# Altium project PA_Channel.PrjPcb
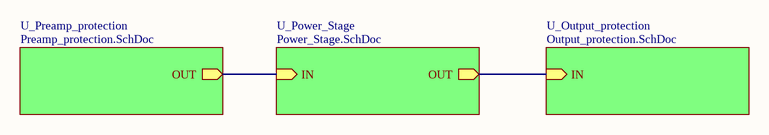
[diagram p0: PA_Channel.SchDoc]
5 sheets, 150 parts. Net scope: hierarchical (ports join the sheet entries above them; power ports are global).
Board files: PA_Channel_RF1.PcbDoc, PA_Channel_RF2.PcbDoc, PA_Channel_RF3.PcbDoc, PA_Channel_RF2_NPTB00004A.PcbDoc
Sheets:
  PA_Channel.SchDoc
    U_Output_protection = Output_protection.SchDoc
    U_Power_Stage = Power_Stage.SchDoc
    U_Preamp_protection = Preamp_protection.SchDoc
  Power_Stage_NPTB00004A.SchDoc

## Sheet PA_Channel.SchDoc
size A4

### Sub-sheets
U_Output_protection = Output_protection.SchDoc: IN (in)
U_Power_Stage = Power_Stage.SchDoc: IN (in), OUT (out)
U_Preamp_protection = Preamp_protection.SchDoc: OUT (out)

### Nets
NetC24_1: sheet U_Power_Stage/IN, sheet U_Preamp_protection/OUT
NetCP1_1: sheet U_Output_protection/IN, sheet U_Power_Stage/OUT

## Sheet Output_protection.SchDoc
size A3
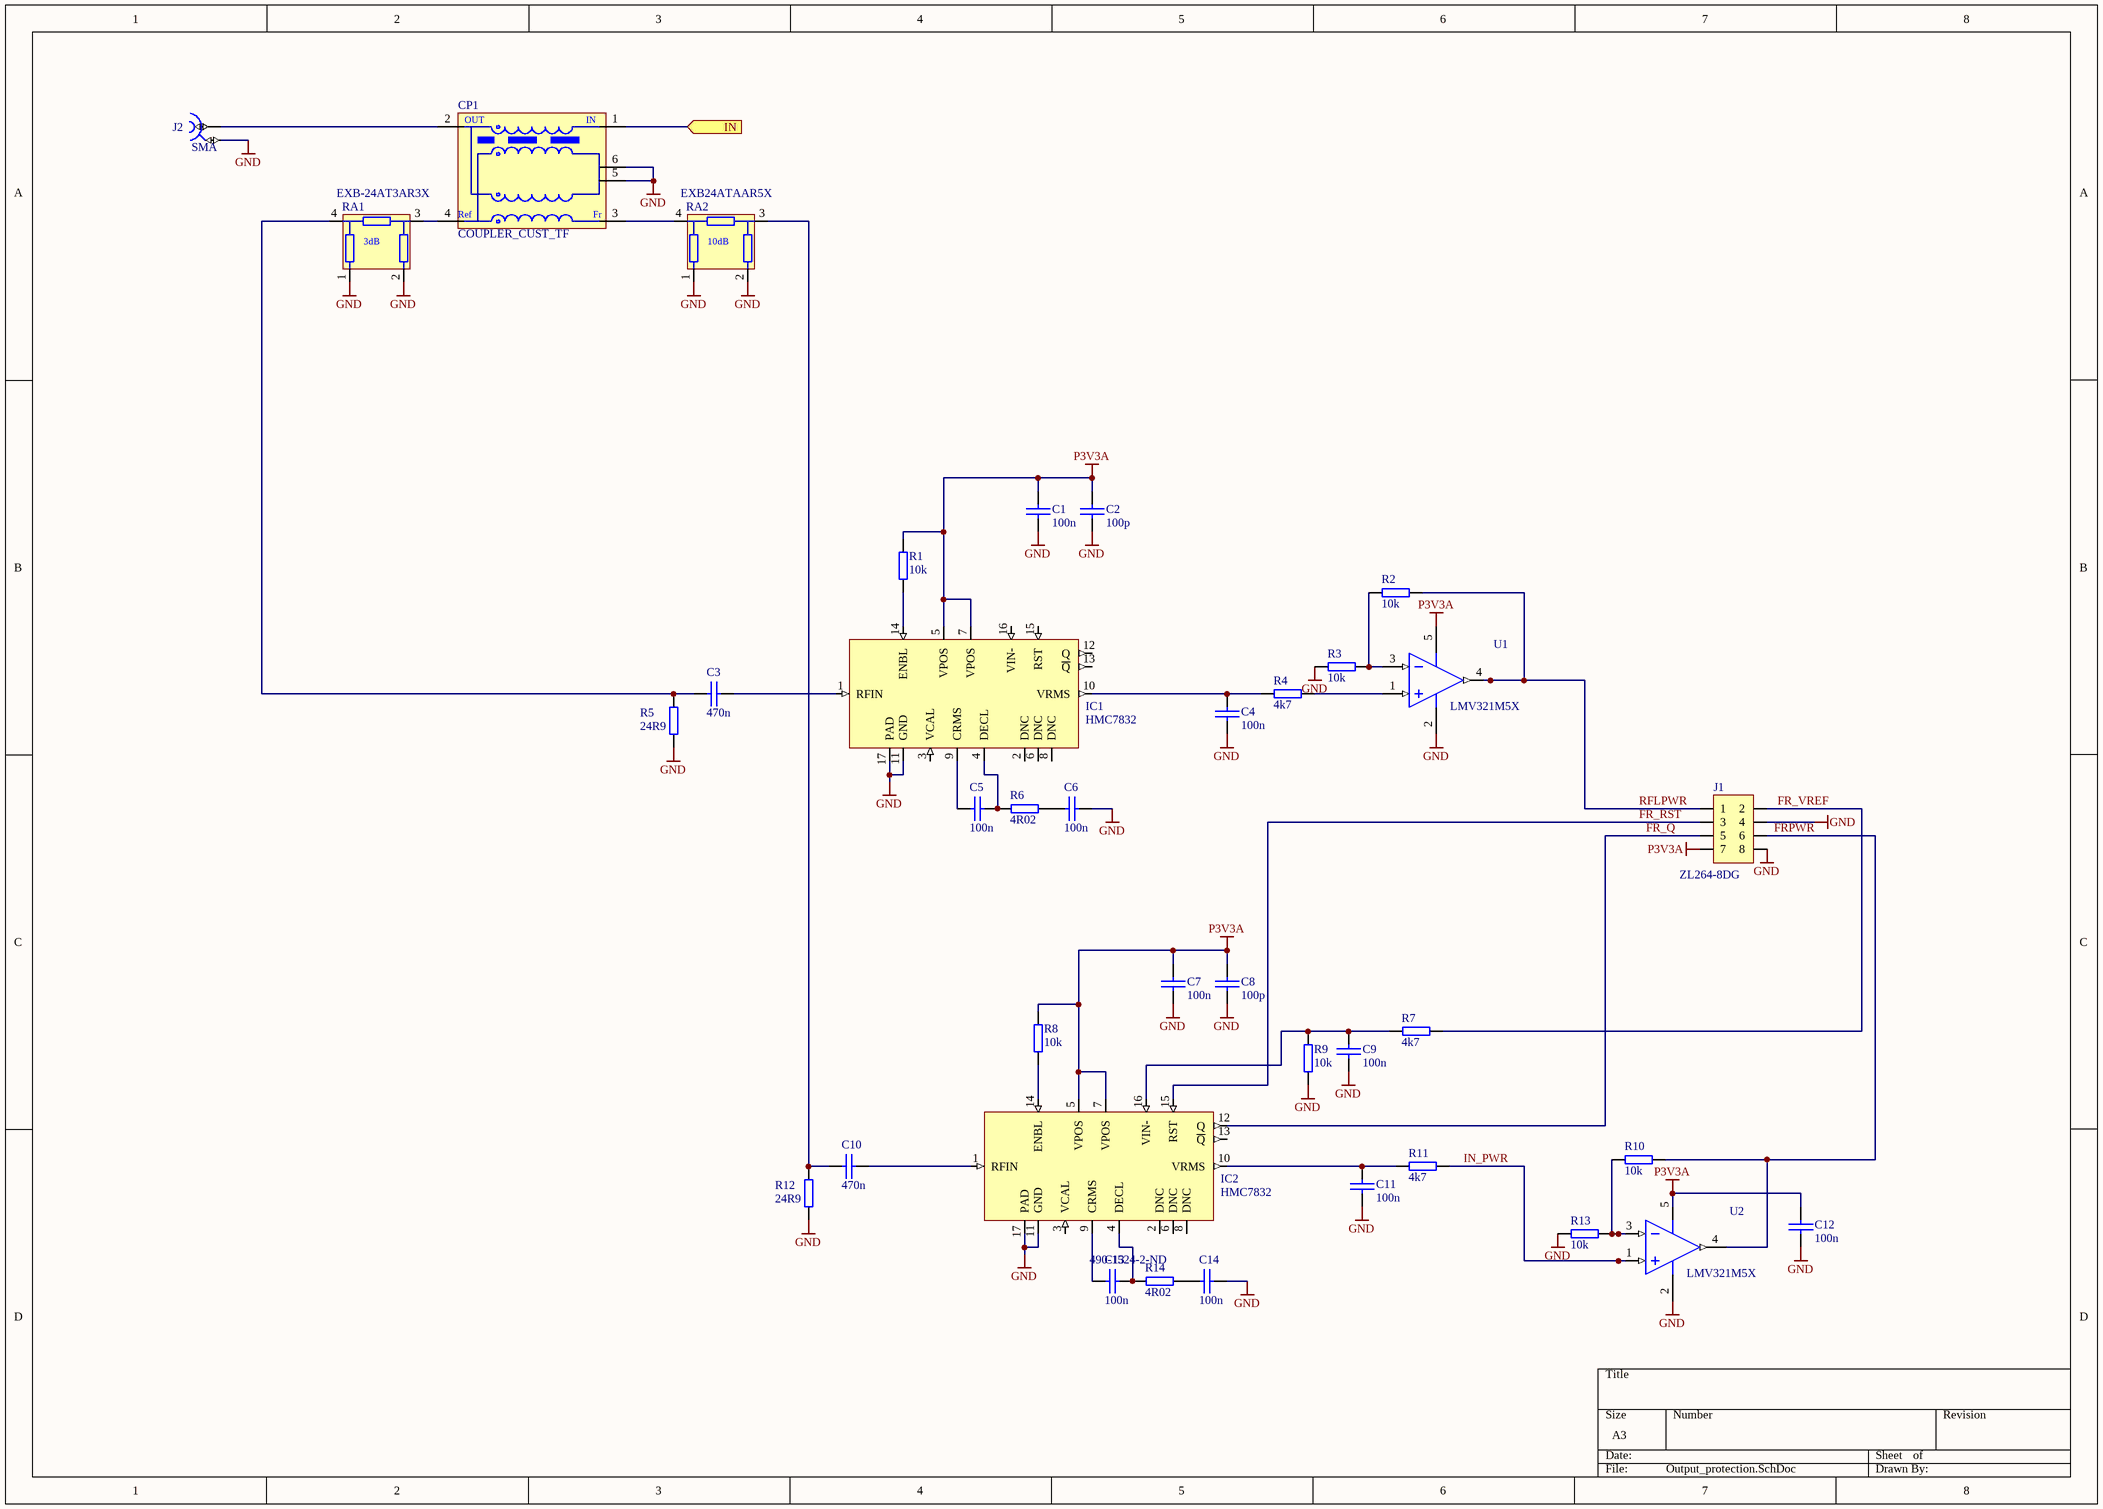
[diagram p1: Output_protection.SchDoc]

### Parts
(Parts that share a designator on the sheet are numbered #1, #2 ... from top to bottom, then left to right.)
C1#1  100n  [0603C]
C2#1  100p  [0603C]
C3#1  470n  [0603C]
C4#1  100n  [0603C]
C5#1  100n  [0603C]
C6  100n  [0603C]
C7  100n  [0603C]
C8  100p  [0603C]
C9  100n  [0603C]
C10  470n  [0603C]
C11  100n  [0603C]
C12  100n  [0603C]
C13  100n  Supplier Part Number 1: 490-1524-2-ND  [0603C]
C14  100n  [0603C]
CP1  COUPLER_CUST_TF  [COUPLER_CUST_TF]
IC1#1  HMC7832  [QFN50P300X300X80_HS-17N]
IC2  HMC7832  [QFN50P300X300X80_HS-17N]
J1  ZL264-8DG  [ZL264-8DG]
J2  SMA  [MOLEX_73251-2121]
R1#1  10k  [0603R]
R2#1  10k  [0603R]
R3  10k  [0603R]
R4  4k7  [0603R]
R5  24R9  [0603R]
R6  4R02  [0603R]
R7  4k7  [0603R]
R8  10k  [0603R]
R9  10k  [0603R]
R10  10k  [0603R]
R11  4k7  [0603R]
R12  24R9  [0603R]
R13  10k  [0603R]
R14  4R02  [0603R]
RA1  EXB-24AT3AR3X  [CAC-65P100X100-4L]
RA2  EXB24ATAAR5X  [CAC-65P100X100-4L]
U1  LMV321M5X  [DBV0005A_N]
U2  LMV321M5X  [DBV0005A_N]

### Ports
IN (in)

### Nets
GND: C1#1.2 C2#1.2 C4#1.1 C6.2 C7.2 C8.2 C9.1 C11.1 C12.1 C14.2 CP1.5 CP1.6 IC1#1.11(GND) IC1#1.17(PAD) IC2.11(GND) IC2.17(PAD) J1.4 J1.8 J2.2 R3.2 R5.2 R9.1 R12.2 R13.2 RA1.1 RA1.2 RA2.1 RA2.2 U1.2(V-) U2.2(V-)
P3V3A: C1#1.1 C2#1.1 C7.1 C8.1 C12.2 IC1#1.5(VPOS) IC1#1.7(VPOS) IC2.5(VPOS) IC2.7(VPOS) J1.7 R1#1.1 R8.1 U1.5(V+) U2.5(V+)
FR_Q: IC2.12(Q) J1.5
FR_RST: IC2.15(RST) J1.3
FR_VREF: J1.2 R7.1
FRPWR: J1.6 R10.1 U2.4(OUT)
IN_PWR: R11.1 U2.1(IN+)
RFLPWR: J1.1 R2#1.1 U1.4(OUT)
NetC3#1_1: C3#1.1 R5.1 RA1.4
NetC3#1_2: C3#1.2 IC1#1.1(RFIN)
NetC4#1_2: C4#1.2 IC1#1.10(VRMS) R4.2
NetC5#1_1: C5#1.1 IC1#1.9(CRMS)
NetC5#1_2: C5#1.2 IC1#1.4(DECL) R6.1
NetC6_1: C6.1 R6.2
NetC9_2: C9.2 IC2.16(VIN-) R7.2 R9.2
NetC10_1: C10.1 R12.1 RA2.3
NetC10_2: C10.2 IC2.1(RFIN)
NetC11_2: C11.2 IC2.10(VRMS) R11.2
NetC13_1: C13.1 IC2.9(CRMS)
NetC13_2: C13.2 IC2.4(DECL) R14.1
NetC14_1: C14.1 R14.2
NetCP1_1: CP1.1 ; port IN
NetCP1_2: CP1.2 J2.1
NetCP1_3: CP1.3 RA2.4
NetCP1_4: CP1.4 RA1.3
NetIC1#1_14: IC1#1.14(ENBL) R1#1.2
NetIC2_14: IC2.14(ENBL) R8.2
NetR2#1_2: R2#1.2 R3.1 U1.3(IN-)
NetR4_1: R4.1 U1.1(IN+)
NetR10_2: R10.2 R13.1 U2.3(IN-)

Not connected (* = marked no-connect by the designer): IC1#1 2(DNC) 3(VCAL) 6(DNC) 8(DNC) 12(Q) 13(~{Q}) 15(RST) 16(VIN-); IC2 2(DNC) 3(VCAL) 6(DNC) 8(DNC) 13(~{Q})

### Notes on the sheet
- (in symbol IND_COUPLER_TF) OUT; IN; Ref; Fr
- (in symbol RES_ATT_3dB) 3dB
- (in symbol RES_ATT_10dB) 10dB

### Library data of the parts
C1#1 C4#1 C5#1 C6 C7 C9 C11-C14 = CAP_SMD_0603: Capacitor SMD; Part: GRM188L81H104KA93D
  C1#1 C4#1 C5#1 C6 C9 C11 C12 C14: Supplier 1: Digi-Key
C2#1 C8 = CAP_SMD_0603: Capacitor SMD; Part: C1608NP01H101J080AA; Supplier 1: Digi-Key
C3#1 C10 = CAP_SMD_0603: Capacitor SMD; Part: GRM188R71A474KA61D; Supplier 1: Digi-Key
CP1 = IND_COUPLER_TF: custom coupler
IC1#1 IC2 = ADL5904: DC   to 6 GHz  , 45 dB DC  to 6 GHz , 45 dB TruPwr Detector with Envelope Threshold Detection
J1 = CON_2X4 2.54 SMT FEM: 2.54mm pitch connector
J2 = MOLEX_73251-2121: Part Description: 50 Ohm, SMA Edge Mount PCB, With Jam Nut And Lock Washer; Manufacturer: MOLEX; PressFit: No; Part Number: MOLEX_73251-2121; Component Kind: Standard; Component Type: Standard; Pin Count: 5; Family: SMA; Mounted: Yes; Socket: No; SMD: Yes; Sense: No; Status: None; Manufacturer Part Number: 73251-2121; ComponentHeight: 5.75mm; HelpURL: \\cern.ch\dfs\Applications\Altium\Datasheets\MOLEX_73251-2121.pdf; Author: CERN DEM JLC; CreateDate: 26.10.2016; LatestRevisionDate: 26.10.2016
R1#1 R2#1 R3 R8-R10 R13 = RES_0603: SMD Resistor; Part: CRCW060310K0FKEA; Supplier 1: Newark
  R2#1 R3 R8 R10 R13: Supplier Part Number 1: 39K0073
R4 R7 R11 = RES_0603: SMD Resistor; Part: CR0603-FX-4701ELF; Supplier 1: Newark; Supplier Part Number 1: 39K0073
R5 R12 = RES_0603: SMD Resistor; Part: CPF0603F24R9C1; Supplier 1: Newark
R6 = RES_0603: SMD Resistor; Part: CRCW06034R02FKEA; Supplier 1: Newark
R14 = RES_0603: SMD Resistor; Supplier 1: Newark; Supplier Part Number 1: 39K0073
RA1 = RES_ATT_3dB: 3dB Chip Attenuator
RA2 = RES_ATT_10dB: 10dB Chip Attenuator
U1 U2 = CMP-0055-01048-3: General Purpose, Low Voltage, Rail-to-Rail Output Operational Amplifiers, 5-pin SOT-23; Manufacturer: Texas Instruments; PackageTopMarking: A13*XTT; PowerWise: N; Package Reference: DBV0005A; PackageDescription: Molded SOT-23, .115 x .063 x .040 in Body, 5 Lead, .0375 in Pitch; CompType: Amplifiers; RoHS: N; ComponentLink1URL: http://www.ti.com/general/docs/lit/getliterature.tsp?genericPartNumber=LMV321-N&fileType=pdf; PinCount: 5; ComponentLink1Description: Datasheet URL

## Sheet Power_Stage.SchDoc
size A4
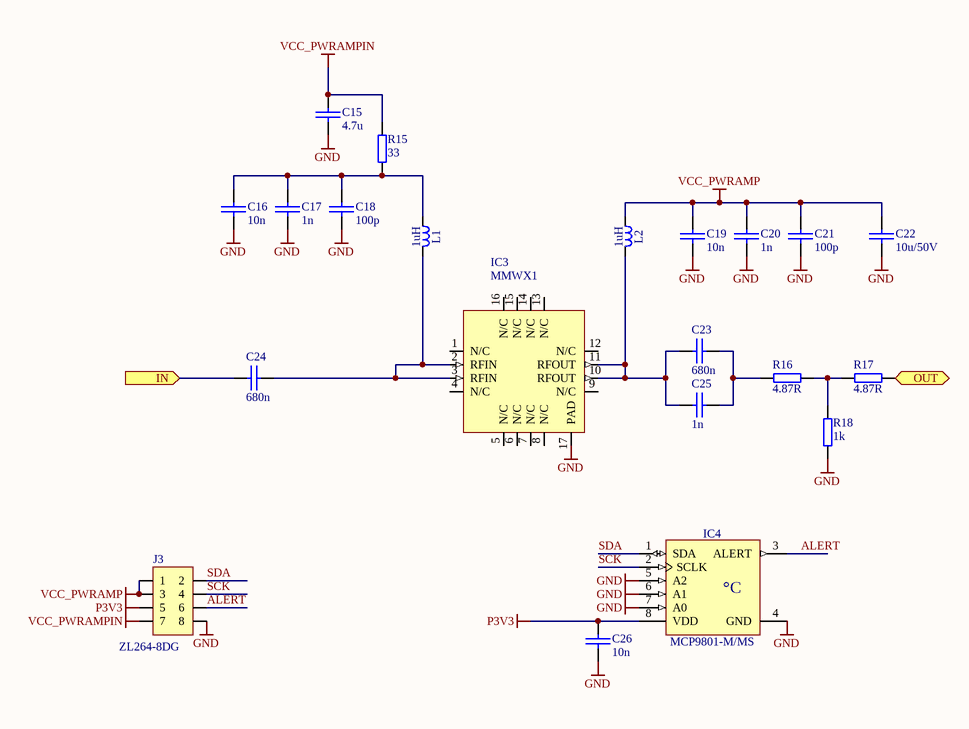
[diagram p2: Power_Stage.SchDoc]

### Parts
(Parts that share a designator on the sheet are numbered #1, #2 ... from top to bottom, then left to right.)
C15#1  4.7u  [0603C]
C16#1  10n  [0603C]
C17#1  1n  [0603C]
C18#1  100p  [0603C]
C19#1  10n  [0603C]
C20#1  1n  [0603C]
C21#1  100p  [0603C]
C22#1  10u/50V  [0805C]
C23  680n  [0603C]
C24  680n  [0603C]
C25  1n  [0603C]
C26#1  10n  [0603C]
IC3  MMWX1  [QFN65P400X400X80_HS-17N]
IC4#1  MCP9801-M/MS  [SOP65P490X110-8N]
J3#1  ZL264-8DG  [ZL264-8DG]
L1#1  1uH  [INDP2520X18L]
L2#1  1uH  [INDP2520X18L]
R15#1  33  [0603R]
R16  4.87R  [0603R]
R17  4.87R  [0603R]
R18  1k  [0603R]

### Ports
IN (in), OUT (out)

### Nets
GND: C15#1.2 C16#1.2 C17#1.2 C18#1.2 C19#1.2 C20#1.2 C21#1.2 C22#1.2 C26#1.1 IC3.17(PAD) IC4#1.4(GND) IC4#1.5(A2) IC4#1.6(A1) IC4#1.7(A0) J3#1.8 R18.1
P3V3: C26#1.2 IC4#1.8(VDD) J3#1.5
VCC_PWRAMP: C19#1.1 C20#1.1 C21#1.1 C22#1.1 J3#1.1 J3#1.3 L2#1.1
VCC_PWRAMPIN: C15#1.1 J3#1.7 R15#1.2
ALERT: IC4#1.3(ALERT) J3#1.6
SCK: IC4#1.2(SCLK) J3#1.4
SDA: IC4#1.1(SDA) J3#1.2
NetC16#1_1: C16#1.1 C17#1.1 C18#1.1 L1#1.1 R15#1.1
NetC23_1: C23.1 C25.1 IC3.10(RFOUT) IC3.11(RFOUT) L2#1.2
NetC23_2: C23.2 C25.2 R16.1
NetC24_1: C24.1 ; port IN
NetC24_2: C24.2 IC3.2(RFIN) IC3.3(RFIN) L1#1.2
NetCP1_1: R17.2 ; port OUT
NetR16_2: R16.2 R17.1 R18.2

Not connected (* = marked no-connect by the designer): IC3 1(N/C) 4(N/C) 5(N/C) 6(N/C) 7(N/C) 8(N/C) 9(N/C) 12(N/C) 13(N/C) 14(N/C) 15(N/C) 16(N/C)

### Notes on the sheet
- (in symbol MCP9801-M/MS) °C

### Library data of the parts
C15#1 = CAP_SMD_0603: Capacitor SMD; Part: GRM21BR71C475KE51L; Supplier 1: Digi-Key; Supplier Part Number 1: 490-1524-2-ND
C16#1 C19#1 = CAP_SMD_0603: Capacitor SMD; Part: GRM1885C1H103JA01D; Supplier 1: Digi-Key; Supplier Part Number 1: 490-1524-2-ND
C17#1 C20#1 C25 = CAP_SMD_0603: Capacitor SMD; Part: GRM1885C1H102JA01D; Supplier 1: Digi-Key; Supplier Part Number 1: 490-1524-2-ND
C18#1 C21#1 = CAP_SMD_0603: Capacitor SMD; Part: C1608NP01H101J080AA; Supplier 1: Digi-Key; Supplier Part Number 1: 490-1524-2-ND
C22#1 = CAP_SMD_0805: Capacitor SMD; Part: GRM32ER71H106KA12L; Supplier 1: Farnell; Supplier Part Number 1: 1833812
C23 C24 = CAP_SMD_0603: Capacitor SMD; Part: GRM1555C1H681GA01; Supplier 1: Digi-Key; Supplier Part Number 1: 490-1524-2-ND
C26#1 = CAP_SMD_0603: Capacitor SMD; Supplier 1: Digi-Key; Supplier Part Number 1: 490-1524-2-ND
IC3 = RF_NPA1003QA
IC4#1 = MCP9801-M/MS: 2-Wire High-Accuracy Temperature Sensor; Manufacturer: MICROCHIP TECHNOLOGIY; PressFit: No; Bonding: No; Part Number: MCP9801-M/MS; Component Kind: Standard; Component Type: Standard; Device: MCP9801-M/MS; PackageDescription: SOP, 0.65mm pitch; 8 pin, 3.00mm W X 3.00mm L X 1.10mm H body, IPC Medium Density; Part Description: 2-Wire High-Accuracy Temperature Sensor; Manufacturer Part Number: MCP9801-M/MS; Pin Count: 8; Case: MSOP8; Mounted: Yes; Socket: No; SMD: Yes; Sense: No; ComponentHeight: 1.1mm; HelpURL: \\cern.ch\dfs\Applications\Altium\Datasheets\MCP9801-M-MS.pdf; Author: CERN DEM JLC; CreateDate: 18.11.2009; LatestRevisionDate: 18.11.2009
J3#1 = CON_2X4 2.54 SMT FEM: 2.54mm pitch connector
L1#1 = L_1008_100u: Part: LQW2UAS1R0J00L; Author: GK
L2#1 = L_1008_100u: 100uH, 60mA, 21R; Part: 1008LS-102XJLB; Author: GK
R15#1 = RES_0603: SMD Resistor; Part: CR0603-FX-33R0ELF; Supplier 1: Newark; Supplier Part Number 1: 39K0073
R16 R17 = RES_0603: SMD Resistor; Part: CPF0603B4R87E1; Supplier 1: Newark; Supplier Part Number 1: 39K0073
R18 = RES_0603: SMD Resistor; Part: RP73PF1J1K0BTDF; Supplier 1: Newark; Supplier Part Number 1: 39K0073

## Sheet Preamp_protection.SchDoc
size A4
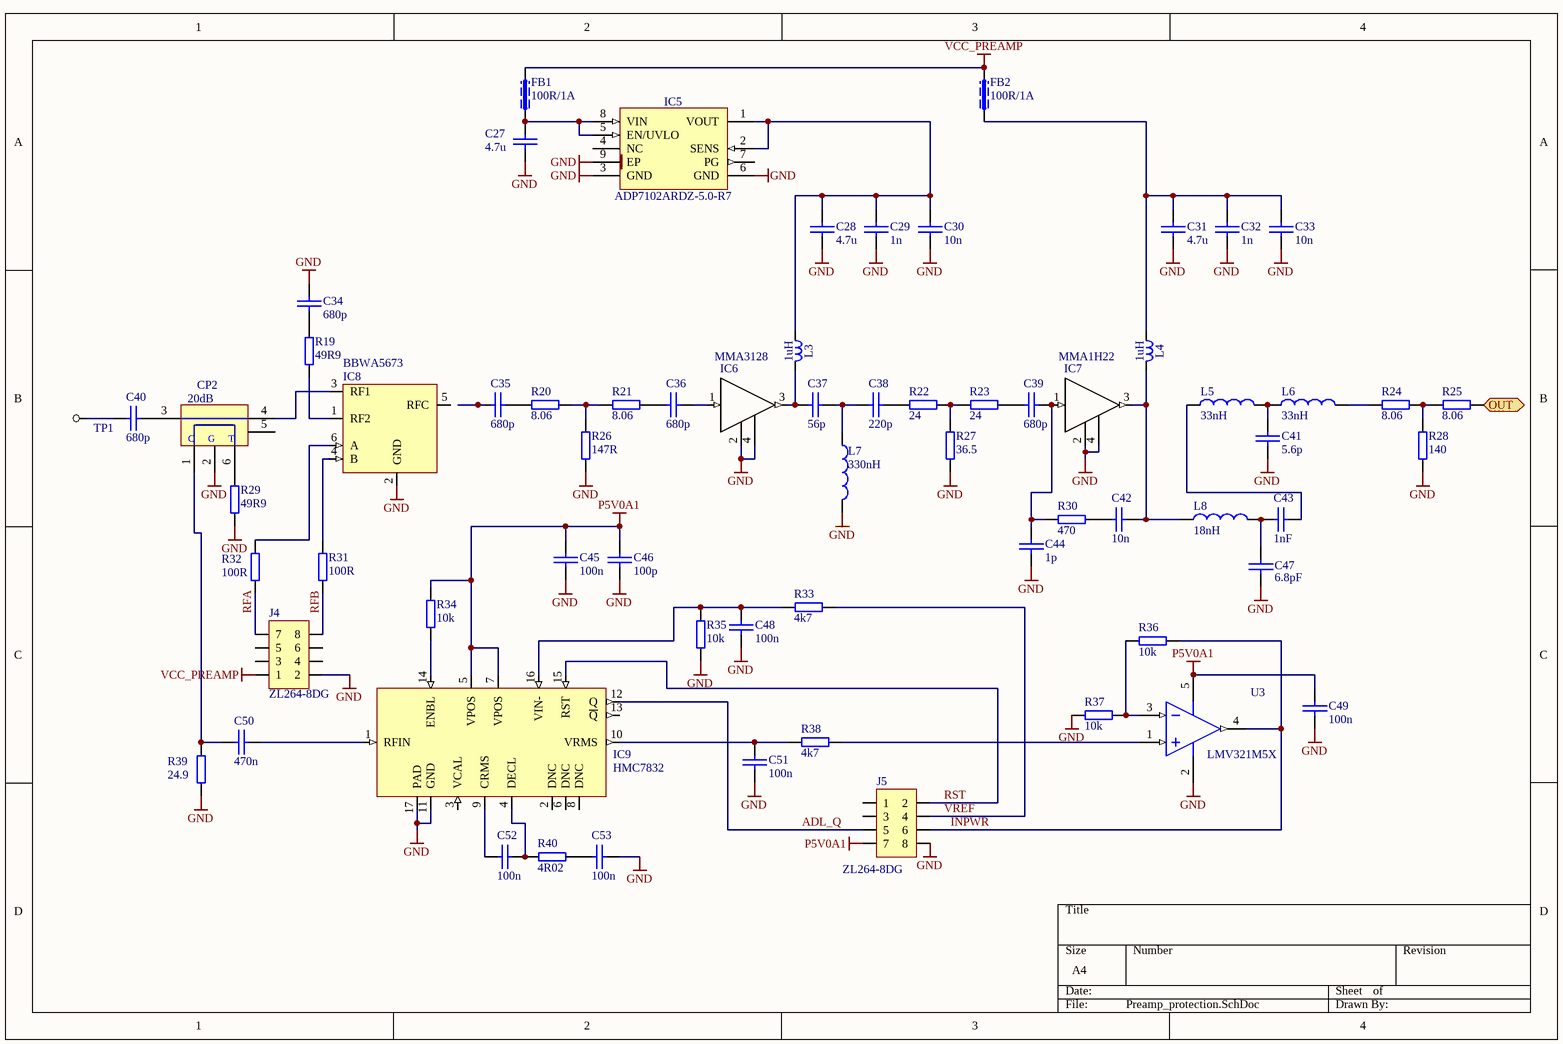
[diagram p3: Preamp_protection.SchDoc]

### Parts
(Parts that share a designator on the sheet are numbered #1, #2 ... from top to bottom, then left to right.)
C27  4.7u  [0603C]
C28  4.7u  [0603C]
C29  1n  [0603C]
C30  10n  [0603C]
C31  4.7u  [0603C]
C32  1n  [0603C]
C33  10n  [0603C]
C34  680p  [0603C]
C35  680p  [0603C]
C36  680p  [0603C]
C37  56p  [0603C]
C38#1  220p  [0603C]
C39  680p  [0603C]
C40  680p  [0603C]
C41  5.6p  [0603C]
C42  10n  [0603C]
C43  1nF  [0603C]
C44  1p  [0603C]
C45  100n  [0603C]
C46  100p  [0603C]
C47  6.8pF  [0603C]
C48  100n  [0603C]
C49  100n  [0603C]
C50  470n  [0603C]
C51  100n  [0603C]
C52  100n  [0603C]
C53  100n  [0603C]
CP2  20dB  [XFMR_MINI-CIRCUITS_AT224]
FB1  100R/1A  [0603L]
FB2  100R/1A  [0603L]
IC5  ADP7102ARDZ-5.0-R7  [SOIC127P600X175-9N-R241X309]
IC6  MMA3128  [SOT89-150P410X170-3N]
IC7  MMA1H22  [SOT89-150P410X170-3N]
IC8  BBWA5673  [SOT95P280X130-6N]
IC9  HMC7832  [QFN50P300X300X80_HS-17N]
J4  ZL264-8DG  [ZL264-8DG]
J5  ZL264-8DG  [ZL264-8DG]
L3#1  1uH  [INDP2520X18L]
L4#1  1uH  [INDP2520X18L]
L5  33nH  [0603L]
L6  33nH  [0603L]
L7  330nH  [0603L]
L8  18nH  [0603L]
R19  49R9  [0603R]
R20  8.06  [0603R]
R21  8.06  [0603R]
R22  24  [0603R]
R23  24  [0603R]
R24  8.06  [0603R]
R25  8.06  [0603R]
R26  147R  [0603R]
R27  36.5  [0603R]
R28  140  [0603R]
R29  49R9  [0603R]
R30  470  [0603R]
R31  100R  [0603R]
R32  100R  [0603R]
R33  4k7  [0603R]
R34  10k  [0603R]
R35  10k  [0603R]
R36  10k  [0603R]
R37  10k  [0603R]
R38  4k7  [0603R]
R39  24.9  [0603R]
R40  4R02  [0603R]
TP1  TP  [testpoint]  (value not drawn)
U3  LMV321M5X  [DBV0005A_N]

### Ports
OUT (out)

### Nets
GND: C27.2 C28.2 C29.2 C30.2 C31.2 C32.2 C33.2 C34.2 C41.1 C44.1 C45.2 C46.2 C47.1 C48.1 C49.1 C51.1 C53.2 CP2.2(NC) IC5.3(GND) IC5.6(GND) IC5.9(EP) IC6.2(G) IC6.4(G) IC7.2(G) IC7.4(G) IC8.2(GND) IC9.11(GND) IC9.17(PAD) J4.2 J5.8 L7.2 R26.1 R27.2 R28.2 R29.2 R35.1 R37.2 R39.2 U3.2(V-)
P5V0A1: C45.1 C46.1 C49.2 IC9.5(VPOS) IC9.7(VPOS) J5.7 R34.1 U3.5(V+)
VCC_PREAMP: FB1.2 FB2.2 J4.1
ADL_Q: IC9.12(Q) J5.5
INPWR: J5.6 R36.1 U3.4(OUT)
RFA: J4.7 R32.2
RFB: J4.8 R31.2
RST: IC9.15(RST) J5.2
VREF: J5.4 R33.1
NetC24_1: R25.1 ; port OUT
NetC27_1: C27.1 FB1.1 IC5.5(EN/UVLO) IC5.8(VIN)
NetC28_1: C28.1 C29.1 C30.1 IC5.1(VOUT) IC5.2(SENS) L3#1.1
NetC31_1: C31.1 C32.1 C33.1 FB2.1 L4#1.1
NetC34_1: C34.1 R19.1
NetC35_2: C35.2 R20.2
NetC36_1: C36.1 R21.1
NetC36_2: C36.2 IC6.1(IN)
NetC37_1: C37.1 IC6.3(OUT) L3#1.2
NetC37_2: C37.2 C38#1.1 L7.1
NetC38#1_2: C38#1.2 R22.2
NetC39_1: C39.1 R23.1
NetC39_2: C39.2 C44.2 IC7.1(IN) R30.2
NetC40_1: C40.1 TP1.1
NetC40_2: C40.2 CP2.3(S)
NetC41_2: C41.2 L5.2 L6.1
NetC42_1: C42.1 R30.1
NetC42_2: C42.2 IC7.3(OUT) L4#1.2 L8.1
NetC43_1: C43.1 L5.1
NetC43_2: C43.2 C47.2 L8.2
NetC48_2: C48.2 IC9.16(VIN-) R33.2 R35.2
NetC50_1: C50.1 CP2.1(SDOT) R39.1
NetC50_2: C50.2 IC9.1(RFIN)
NetC51_2: C51.2 IC9.10(VRMS) R38.2
NetC52_1: C52.1 IC9.9(CRMS)
NetC52_2: C52.2 IC9.4(DECL) R40.1
NetC53_1: C53.1 R40.2
NetCP2_4: CP2.4(P) IC8.3(RF1)
NetCP2_6: CP2.6(PDOT) R29.1
NetIC8_1: IC8.1(RF2) R19.2
NetIC8_4: IC8.4(B) R31.1
NetIC8_6: IC8.6(A) R32.1
NetIC9_14: IC9.14(ENBL) R34.2
NetL6_2: L6.2 R24.2
NetR20_1: R20.1 R21.2 R26.2
NetR22_1: R22.1 R23.2 R27.1
NetR24_1: R24.1 R25.2 R28.1
NetR36_2: R36.2 R37.1 U3.3(IN-)
NetR38_1: R38.1 U3.1(IN+)

Not connected (* = marked no-connect by the designer): C35 1; CP2 5(P); IC5 4(NC) 7(PG); IC8 5(RFC); IC9 2(DNC) 3(VCAL) 6(DNC) 8(DNC) 13(~{Q}); J4 3 4 5 6; J5 1 3

### Notes on the sheet
- (in symbol RF_Coupler_TCD-20-4X) C; G; T

### Library data of the parts
C27 C28 C31 = CAP_SMD_0603: Capacitor SMD; Part: GRM21BR71C475KE51L; Supplier 1: Digi-Key; Supplier Part Number 1: 490-1524-2-ND
C29 C32 = CAP_SMD_0603: Capacitor SMD; Part: GRM1885C1H102JA01D; Supplier 1: Digi-Key; Supplier Part Number 1: 490-1524-2-ND
C30 C33 = CAP_SMD_0603: Capacitor SMD; Part: GRM1885C1H103JA01D; Supplier 1: Digi-Key; Supplier Part Number 1: 490-1524-2-ND
C34-C36 C39 C40 C42 C44 = CAP_SMD_0603: Capacitor SMD; Part: GRM1555C1H681GA01; Supplier 1: Digi-Key; Supplier Part Number 1: 490-1524-2-ND
C37 = CAP_SMD_0603: Capacitor SMD; Part: GRM1885C1H560GA01J; Supplier 1: Digi-Key; Supplier Part Number 1: 490-1524-2-ND
C38#1 = CAP_SMD_0603: Capacitor SMD; Part: GRM1885C1H221GA01D; Supplier 1: Digi-Key; Supplier Part Number 1: 490-1524-2-ND
C41 C43 C47 = CAP_SMD_0603: Capacitor SMD; Part: GQM1885C2A5R6BB01D; Supplier 1: Digi-Key; Supplier Part Number 1: 490-1524-2-ND
C45 C48 C49 C51-C53 = CAP_SMD_0603: Capacitor SMD; Part: GRM188L81H104KA93D; Supplier 1: Digi-Key
  C45 C48 C51-C53: Supplier Part Number 1: 490-1524-2-ND
C46 = CAP_SMD_0603: Capacitor SMD; Part: C1608NP01H101J080AA; Supplier 1: Digi-Key; Supplier Part Number 1: 490-1524-2-ND
C50 = CAP_SMD_0603: Capacitor SMD; Part: GRM188R71A474KA61D; Supplier 1: Digi-Key; Supplier Part Number 1: 490-1524-2-ND
CP2 = RF_Coupler_TCD-20-4X: 50 Ohms directional coupler; Part Number: XFMR_MINI-CIRCUITS_TCD-20-4X+; Part Description: 50 Ohms 4.5 To 3000MHz RF Transformer; Manufacturer: MINI-CIRCUITS; Manufacturer Part Number: TCD-20-4X+; Component Kind: Standard; Component Type: Standard; Pin Count: 5; Value: 20dB; Status: None; Mounted: Yes; Socket: No; Sense: No; SMD: Yes; ComponentHeight: 3.81mm; HelpURL: \\cern.ch\dfs\Applications\Altium\Datasheets\XFMR_MINI-CIRCUITS_TC1-1-13M+.pdf; Author: GK; CreateDate: 30.11.2011; LatestRevisionDate: 30.11.2011
FB1 FB2 = L_FERRITE_BEAD_0603: ferrite bead 100R@100MHz 1A; Supplier 1: Newark; Supplier Part Number 1: 89R3144
IC5 = ADP7102ARDZ-5.0-R7: 300 mA, Low Noise, CMOS LDO Linear Regulator; Part Description: 5V, 300mA, Low Noise, CMOS LDO Linear Regulator; Manufacturer: ANALOG DEVICES; PressFit: No; Bonding: No; Part Number: ADP7102ARDZ-5.0-R7; Component Kind: Standard; Component Type: Standard; Device: ADP7102ARDZ-5.0-R7; PackageDescription: SOIC 8, Pitch 1.27mm - Body 3.9x4.9mm, (w/thermal tab 2.41mm X 3.098mm), IPC Medium Density; Manufacturer Part Number: ADP7102ARDZ-5.0-R7; Pin Count: 8; Case: SOIC8; Mounted: Yes; Socket: No; SMD: Yes; Sense: No; ComponentHeight: 1.75mm; HelpURL: \\cern.ch\dfs\Applications\Altium\Datasheets\ADP7102ARDZ-5.0-R7.pdf; Author: CERN DEM JLC; CreateDate: 17.03.2014; LatestRevisionDate: 17.03.2014
IC6 = RF_MMG3012N: Broadband High Linearity Amplifier
IC7 = RF_MMG3H21N: Broadband High Linearity Amplifier
IC8 = RF_HMC544AE
IC9 = ADL5904: as IC1#1 on sheet Output_protection
J4 J5 = CON_2X4 2.54 SMT FEM: 2.54mm pitch connector
L3#1 L4#1 = L_1008_100u: 100uH, 60mA, 21R; Part: LQW2UAS1R0J00L; Case: 1008; SMD: Yes; Author: GK
L5 L6 L8 = L_0603_1uH: 1uH, 25mA, 0.6R; Part: LQW18AS33NG00D; Supplier 1: Newark; Supplier Part Number 1: 42M2122
L7 = L_0603_1uH: 1uH, 25mA, 0.6R; Part: LQW18ANR33G00D; Supplier 1: Newark; Supplier Part Number 1: 42M2122
R19 R29 = RES_0603: SMD Resistor; Part: MCT0603PD4999DP500; Supplier 1: Newark; Supplier Part Number 1: 39K0073
R20 R21 R24 R25 = RES_0603: SMD Resistor; Part: CPF0805B8R06E1; Supplier 1: Newark; Supplier Part Number 1: 39K0073
R22 R23 R30 = RES_0603: SMD Resistor; Part: CPF0805B24RE1; Supplier 1: Newark; Supplier Part Number 1: 39K0073
R26 = RES_0603: SMD Resistor; Part: CPF0805B147RE1; Supplier 1: Newark; Supplier Part Number 1: 39K0073
R27 = RES_0603: SMD Resistor; Part: CPF0805B36R5E1; Supplier 1: Newark; Supplier Part Number 1: 39K0073
R28 = RES_0603: SMD Resistor; 140: CPF0805B147RE1; Supplier 1: Newark; Supplier Part Number 1: 39K0073
R31 R32 = RES_0603: SMD Resistor; Part: CRCW0603100RJNEA; Supplier 1: Newark; Supplier Part Number 1: 39K0073
R33 R38 = RES_0603: SMD Resistor; Part: CR0603-FX-4701ELF; Supplier 1: Newark; Supplier Part Number 1: 39K0073
R34-R37 = RES_0603: SMD Resistor; Part: CRCW060310K0FKEA; Supplier 1: Newark; Supplier Part Number 1: 39K0073
R39 = RES_0603: SMD Resistor; Part: CPF0603F24R9C1; Supplier 1: Newark; Supplier Part Number 1: 39K0073
R40 = RES_0603: SMD Resistor; Part: CRCW06034R02FKEA; Supplier 1: Newark; Supplier Part Number 1: 39K0073
TP1 = TP: Testpoint
U3 = CMP-0055-01048-3: as U1 on sheet Output_protection; Package Reference: DBV0005A; PackageDescription: Molded SOT-23, .115 x .063 x .040 in Body, 5 Lead, .0375 in Pitch; CompType: Amplifiers; RoHS: N; ComponentLink1URL: http://www.ti.com/general/docs/lit/getliterature.tsp?genericPartNumber=LMV321-N&fileType=pdf; PinCount: 5; ComponentLink1Description: Datasheet URL

## Sheet Power_Stage_NPTB00004A.SchDoc
size A4
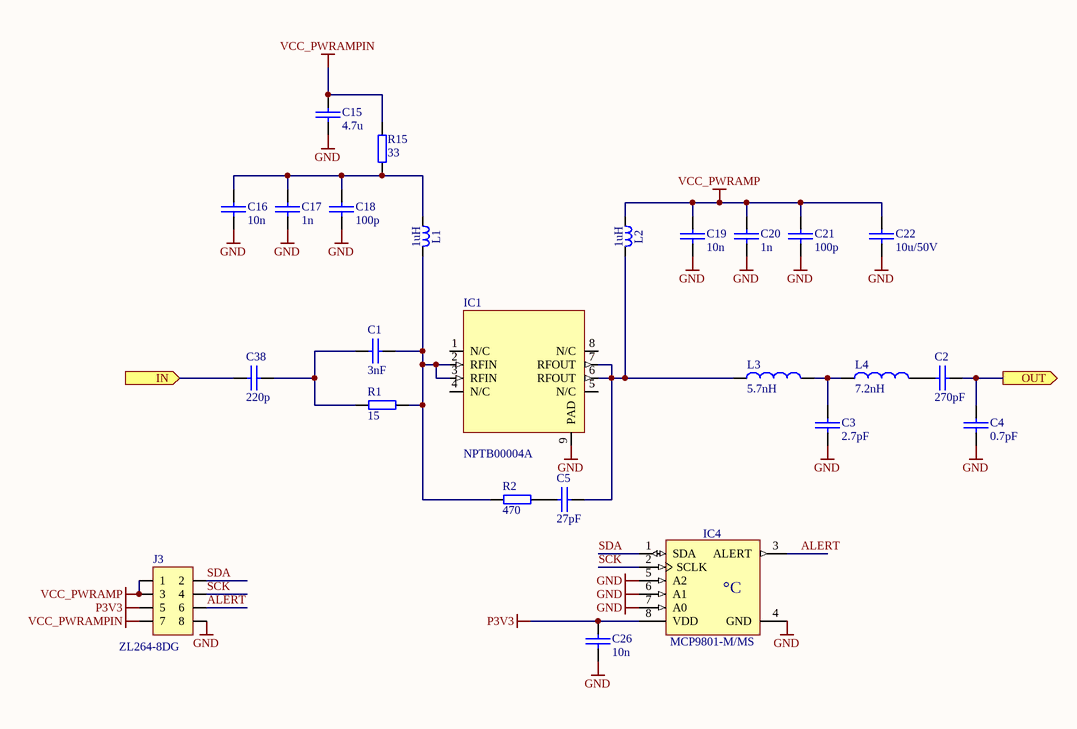
[diagram p4: Power_Stage_NPTB00004A.SchDoc]

### Parts
(Parts that share a designator on the sheet are numbered #1, #2 ... from top to bottom, then left to right.)
C1#2  3nF  [0603C]
C2#2  270pF  [0603C]
C3#2  2.7pF  [0603C]
C4#2  0.7pF  [0603C]
C5#2  27pF  [0603C]
C15#2  4.7u  [0603C]
C16#2  10n  [0603C]
C17#2  1n  [0603C]
C18#2  100p  [0603C]
C19#2  10n  [0603C]
C20#2  1n  [0603C]
C21#2  100p  [0603C]
C22#2  10u/50V  [0805C]
C26#2  10n  [0603C]
C38#2  220p  [0603C]
IC1#2  NPTB00004A  [SOIC127P610X150_HS-8N]
IC4#2  MCP9801-M/MS  [SOP65P490X110-8N]
J3#2  ZL264-8DG  [ZL264-8DG]
L1#2  1uH  [INDP2520X18L]
L2#2  1uH  [INDP2520X18L]
L3#2  5.7nH  [0603L]
L4#2  7.2nH  [0603L]
R1#2  15  [0603R]
R2#2  470  [0603R]
R15#2  33  [0603R]

### Ports
IN (in), OUT (out)

### Nets
GND: C3#2.2 C4#2.2 C15#2.2 C16#2.2 C17#2.2 C18#2.2 C19#2.2 C20#2.2 C21#2.2 C22#2.2 C26#2.1 IC1#2.9(PAD) IC4#2.4(GND) IC4#2.5(A2) IC4#2.6(A1) IC4#2.7(A0) J3#2.8
P3V3: C26#2.2 IC4#2.8(VDD) J3#2.5
VCC_PWRAMP: C19#2.1 C20#2.1 C21#2.1 C22#2.1 J3#2.1 J3#2.3 L2#2.1
VCC_PWRAMPIN: C15#2.1 J3#2.7 R15#2.2
ALERT: IC4#2.3(ALERT) J3#2.6
SCK: IC4#2.2(SCLK) J3#2.4
SDA: IC4#2.1(SDA) J3#2.2
NetC1#2_1: C1#2.1 C38#2.2 R1#2.1
NetC1#2_2: C1#2.2 IC1#2.2(RFIN) IC1#2.3(RFIN) L1#2.2 R1#2.2 R2#2.1
NetC2#2_1: C2#2.1 L4#2.2
NetC2#2_2: C2#2.2 C4#2.1 ; port OUT
NetC3#2_1: C3#2.1 L3#2.2 L4#2.1
NetC5#2_1: C5#2.1 R2#2.2
NetC5#2_2: C5#2.2 IC1#2.6(RFOUT) IC1#2.7(RFOUT) L2#2.2 L3#2.1
NetC16#2_1: C16#2.1 C17#2.1 C18#2.1 L1#2.1 R15#2.1
NetC38#2_1: C38#2.1 ; port IN

Not connected (* = marked no-connect by the designer): IC1#2 1(N/C) 4(N/C) 5(N/C) 8(N/C)

### Notes on the sheet
- (in symbol MCP9801-M/MS) °C

### Library data of the parts
C1#2 C2#2 C3#2 C4#2 C5#2 C26#2 = CAP_SMD_0603: Capacitor SMD
  C3#2 C4#2 C26#2: Supplier 1: Digi-Key; Supplier Part Number 1: 490-1524-2-ND
C15#2 = CAP_SMD_0603: Capacitor SMD; Part: GRM21BR71C475KE51L; Supplier 1: Digi-Key; Supplier Part Number 1: 490-1524-2-ND
C16#2 C19#2 = CAP_SMD_0603: Capacitor SMD; Part: GRM1885C1H103JA01D; Supplier 1: Digi-Key; Supplier Part Number 1: 490-1524-2-ND
C17#2 C20#2 = CAP_SMD_0603: Capacitor SMD; Part: GRM1885C1H102JA01D; Supplier 1: Digi-Key; Supplier Part Number 1: 490-1524-2-ND
C18#2 C21#2 = CAP_SMD_0603: Capacitor SMD; Part: C1608NP01H101J080AA; Supplier 1: Digi-Key; Supplier Part Number 1: 490-1524-2-ND
C22#2 = CAP_SMD_0805: Capacitor SMD; Part: GRM32ER71H106KA12L; Supplier 1: Farnell; Supplier Part Number 1: 1833812
C38#2 = CAP_SMD_0603: Capacitor SMD; Part: GRM1885C1H221GA01D; Supplier 1: Digi-Key; Supplier Part Number 1: 490-1524-2-ND
IC1#2 = RF_NPTB00004A: GaN Wideband Transistor 28 V, 5 W DC  - 6 GHz
IC4#2 = MCP9801-M/MS: as IC4#1 on sheet Power_Stage; Part Number: MCP9801-M/MS; Component Kind: Standard; Component Type: Standard; Device: MCP9801-M/MS; PackageDescription: SOP, 0.65mm pitch; 8 pin, 3.00mm W X 3.00mm L X 1.10mm H body, IPC Medium Density; Part Description: 2-Wire High-Accuracy Temperature Sensor; Manufacturer Part Number: MCP9801-M/MS; Pin Count: 8; Case: MSOP8; Mounted: Yes; Socket: No; SMD: Yes; Sense: No; ComponentHeight: 1.1mm; HelpURL: \\cern.ch\dfs\Applications\Altium\Datasheets\MCP9801-M-MS.pdf; Author: CERN DEM JLC; CreateDate: 18.11.2009; LatestRevisionDate: 18.11.2009
J3#2 = CON_2X4 2.54 SMT FEM: 2.54mm pitch connector
L1#2 = L_1008_100u: Part: LQW2UAS1R0J00L; Author: GK
L2#2 = L_1008_100u: 100uH, 60mA, 21R; Part: 1008LS-102XJLB; Author: GK
L3#2 L4#2 = L_0603: SMT inductor
R1#2 R2#2 = RES_0603: SMD Resistor
R15#2 = RES_0603: SMD Resistor; Part: CR0603-FX-33R0ELF; Supplier 1: Newark; Supplier Part Number 1: 39K0073

## Nets that join several sheets
GND: Output_protection (30 pins), Power_Stage (16 pins), Preamp_protection (39 pins), Power_Stage_NPTB00004A (17 pins)
P3V3: Power_Stage (C26#1.2 IC4#1.8 J3#1.5), Power_Stage_NPTB00004A (C26#2.2 IC4#2.8 J3#2.5)
VCC_PWRAMP: Power_Stage (7 pins), Power_Stage_NPTB00004A (7 pins)
VCC_PWRAMPIN: Power_Stage (C15#1.1 J3#1.7 R15#1.2), Power_Stage_NPTB00004A (C15#2.1 J3#2.7 R15#2.2)
NetC24_1: Power_Stage (C24.1), Preamp_protection (R25.1)
NetCP1_1: Output_protection (CP1.1), Power_Stage (R17.2)